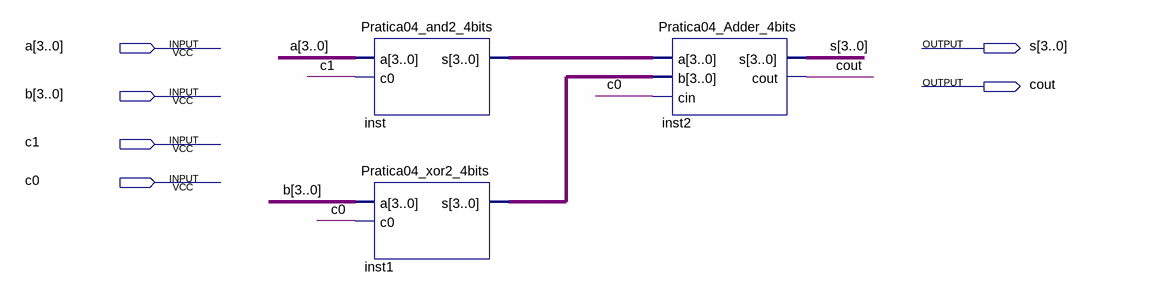
[diagram p0: schematic sheet]
// Quartus schematic Pratica04_Bloco_Aritmetico.bdf as structural Verilog: 3 symbols, 6 pins
module Pratica04_Bloco_Aritmetico (
  input  [3:0] a,
  input  [3:0] b,
  input  c1,
  input  c0,
  output [3:0] s,
  output cout
);

  wire [3:0] inst1_s, inst_s;

  Pratica04_and2_4bits inst (.a(a), .c0(c1), .s(inst_s));
  Pratica04_xor2_4bits inst1 (.a(b), .c0(c0), .s(inst1_s));
  Pratica04_Adder_4bits inst2 (.a(inst_s), .b(inst1_s), .cin(c0), .s(s), .cout(cout));
endmodule
